# EasyEDA Pro project design-2.eprj, board PCB4_1
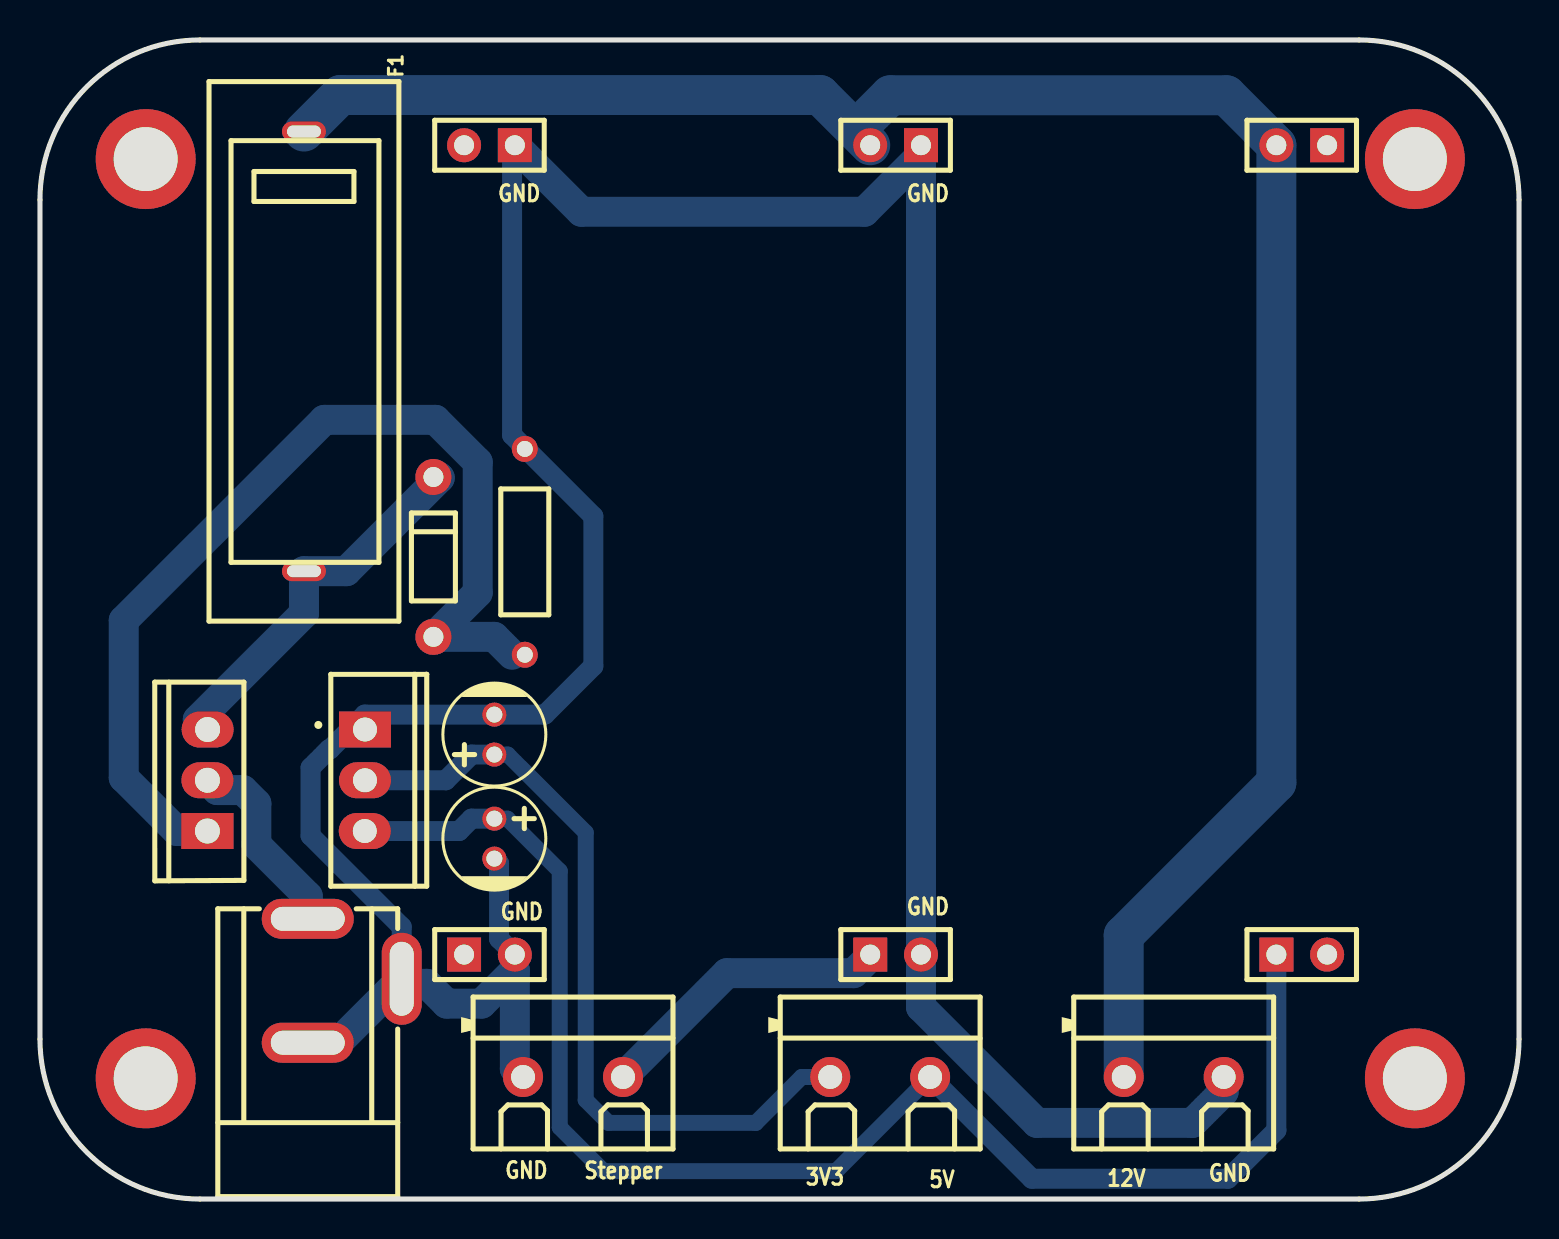
[diagram p2: board, top side]
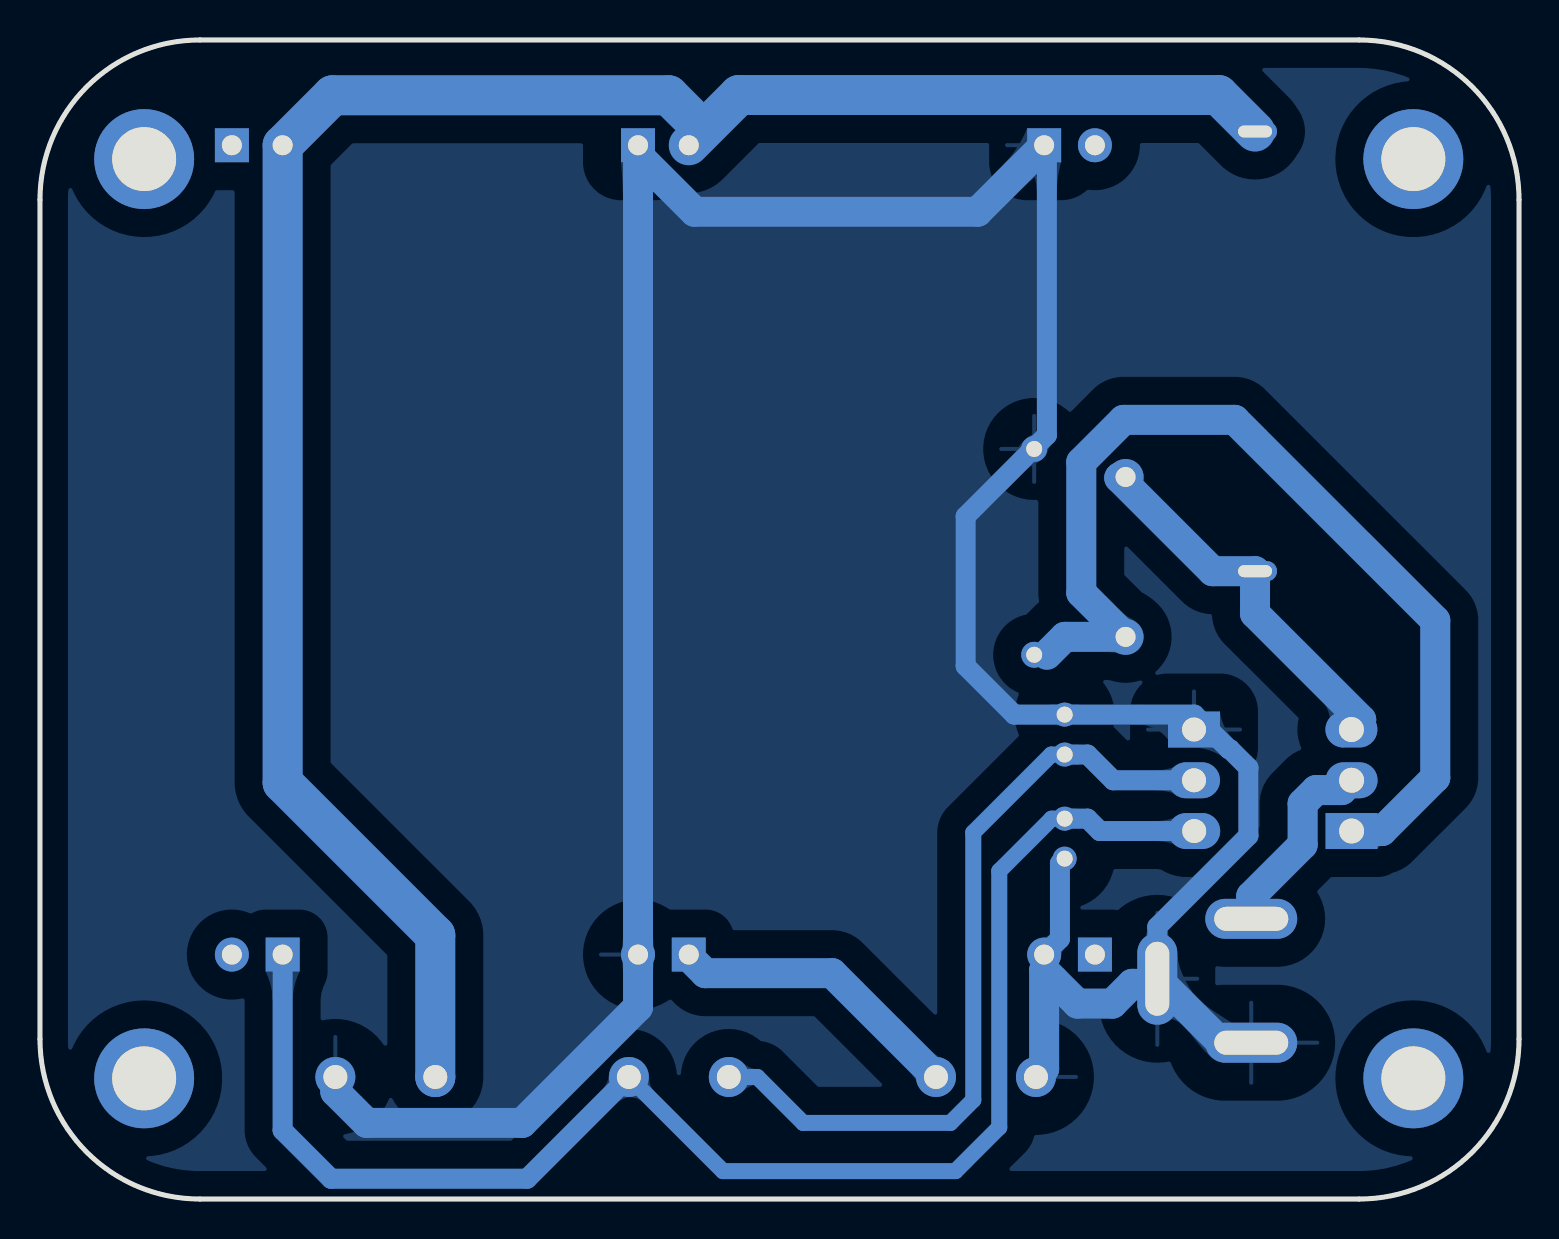
[diagram p3: board, bottom side, seen from below]

Outline 74 x 58 mm; copper layers: Top Layer, Bottom Layer. Coordinates in mm from the lower left corner of the outline.
Outline path: 0,50 arc(2.34,55.66) 8,58 66,58 arc(71.66,55.66) 74,50 74,8 arc(71.66,2.34) 66,0 8,0 arc(2.34,2.34) 0,8 0,50
Stack: Top Layer 0.035mm / Dielectric1 1.51mm FR4 er 4.5 / Bottom Layer 0.035mm

## Design rules (mm)
template: Custom Config
spacing copperThickness1oz (default): track to track 0.4, other pairs 0.4 to 0.6
spacing copperThickness2oz: track to track 0.203, other pairs 0.152 to 0.3
track width copperThickness1oz (default): min 0.4, default 0.5, max 2.54
track width copperThickness2oz: min 0.203, default 0.254, max 2.54
differential pair differentialPair (default): width min 0.127, default 0.254, max 2.54; gap min 0.152, default 0.152
via viaSize (default): diameter min 1.2, default 1.2, max 10; hole min 0.6, default 0.6, max 6.3

## Placement (name value [footprint] x y rotation side)
5V_SHARED+GND_IN1  KF301-2P接线端子  [CONN-TH_XY301V-A-5.0-2P]  42.04 6.11 180 top
5V_STEPPER+GND  KF301-2P接线端子  [CONN-TH_XY301V-A-5.0-2P]  26.67 6.11 180 top
12V_MAIN+GND  KF301-2P接线端子  [CONN-TH_XY301V-A-5.0-2P]  56.72 6.11 180 top
Buck_Pins_#1  2.54-1*2P母  [HDR-TH_2P-P2.54-V-F]  63.13 52.73 180 top
Buck_Pins_#2  2.54-1*2P母  [HDR-TH_2P-P2.54-V-F]  63.13 12.23 0 top
Buck_Pins_#3  2.54-1*2P母  [HDR-TH_2P-P2.54-V-F]  42.81 52.73 180 top
Buck_Pins_#4  2.54-1*2P母  [HDR-TH_2P-P2.54-V-F]  42.81 12.23 0 top
Buck_Pins_#7  2.54-1*2P母  [HDR-TH_2P-P2.54-V-F]  22.49 52.73 180 top
Buck_Pins_#8  2.54-1*2P母  [HDR-TH_2P-P2.54-V-F]  22.49 12.23 0 top
C1  10uF  [CAP-TH_BD5.0-P2.00-D0.6-FD]  22.73 18.03 270 top
C2  10uF  [CAP-TH_BD5.0-P2.00-D0.6-FD]  22.73 23.24 90 top
D4  1N4148  [DO-35_BD2.0-L4.0-P8.00-D0.5-FD]  19.68 32.13 90 top
F1  5x20 BLX-A型 保险丝支架 XC-7  [FUSE-TH_L22.6-W9.0]  13.21 42.42 270 top
Input_Jack  DC005  [DC-IN-TH_DC005]  15.75 10.92 90 top
Mosfet  IRF4905  [TO-220-3_L9.9-W4.5-P2.54-L-1]  8.38 20.95 90 top
NOREF  -  [Pad_e19]  68.79 52.04 0 top
NOREF#2  -  [Pad_e17]  5.29 6.04 0 top
NOREF#3  -  [Pad_e14]  5.29 52.04 0 top
NOREF#4  -  [Pad_e15]  68.79 6.04 0 top
R1  100kΩ  [RES-TH_BD2.4-L6.3-P10.30-D0.6]  24.26 32.38 270 top
U7  LD1117V33  [TO-220-3_L10.0-W4.5-P2.54-L]  16.26 20.95 270 top

## Footprints (pads in the part's own frame, mm; a bottom-side part is the same pattern mirrored in y, then rotated)
CAP-TH_BD5.0-P2.00-D0.6-FD
  round 1.202 hole 0.801: 1(-1,0) 2(1,0)
CONN-TH_XY301V-A-5.0-2P
  round 2 hole 1.2: 1(-2.5,0) 2(2.5,0)
DC-IN-TH_DC005
  oval 2x4.6 hole 1.2x3.7: 1(3.1,2.35) 2(-3.1,2.35)
  oval 4.6x2 hole 3.7x1.2: 3(0.1,-2.35)
DO-35_BD2.0-L4.0-P8.00-D0.5-FD
  round 1.8 hole 1: 1(-4,0) 2(4,0)
FUSE-TH_L22.6-W9.0
  oval 1x2.2 hole 0.6x1.7: 1(-11,0) 2(11,0)
HDR-TH_2P-P2.54-V-F
  rect 1.7x1.7 hole 1: 1(-1.27,0)
  round 1.7 hole 1: 2(1.27,0)
Pad_e14
  round 5 hole 3.2: 1(0,0)
Pad_e15
  round 5 hole 3.2: 1(0,0)
Pad_e17
  round 5 hole 3.2: 1(0,0)
Pad_e19
  round 5 hole 3.2: 1(0,0)
RES-TH_BD2.4-L6.3-P10.30-D0.6
  round 1.3 hole 0.8: 1(-5.15,0) 2(5.15,0)
TO-220-3_L9.9-W4.5-P2.54-L-1
  rect 1.8x2.6 hole 1.25: 1(-2.54,0.005)
  oval 1.8x2.6 hole 1.25: 2(0,0.005) 3(2.54,-0.005)
TO-220-3_L10.0-W4.5-P2.54-L
  rect 1.8x2.6 hole 1.2: 1(-2.54,0.005)
  oval 1.8x2.6 hole 1.2: 2(0,0.005) 3(2.54,-0.005)

## Nets
As in the schematic.

Pads without a net: Buck_Pins_#1 1; Buck_Pins_#2 2; Buck_Pins_#7 2; Buck_Pins_#8 1; NOREF 1; NOREF#2 1; NOREF#3 1; NOREF#4 1

## Routing (per net, layer and track width the routed paths; a pad name or vN(x,y) marks a point on that pad's centre or on a via; arc(x,y) is an arc through that point)
3V3_REF: length 41
  Bottom Layer w0.8: 5V_SHARED+GND_IN1.2 38.11,6.11 35.81,3.81 28.45,3.81 27.3,4.95 27.3,18.34 23.4,22.24 C2.1
  Bottom Layer w1: C2.1 21.59,22.24 20.3,20.95 15.5,20.95
5V_SHARED: length 75.3
  Bottom Layer w0.8: 5V_SHARED+GND_IN1.1 39.83,1.4 28.19,1.4 26.01,3.59 26.01,16.41 23.38,19.03 C1.1
  Bottom Layer w1: C1.1 21.59,19.03 20.97,18.41 15.49,18.41 ; 5V_SHARED+GND_IN1.1 49.63,1.02 59.44,1.02 61.86,3.44 Buck_Pins_#2.1
5V_STEPPER: length 15
  Bottom Layer w1.5: 41.54,12.23 41.54,12.13 40.71,11.3 34.37,11.3 5V_STEPPER+GND.1
12V_MAIN: length 101.6
  Bottom Layer w2: F1.1 15.03,55.24 39.03,55.24 41.54,52.73 ; 41.58,54.27 42.55,55.23 59.36,55.23 Buck_Pins_#1.2 61.86,20.84 54.22,13.2 12V_MAIN+GND.2
GND: length 165.1
  Bottom Layer w1: Buck_Pins_#8.2 22.97,13.02 22.97,16.8 C1.2 ; Buck_Pins_#7.1 23.62,52.59 23.62,38.23 27.69,34.16 27.69,26.67 25.26,24.24 C2.2 16.24,24.24 14.51,22.5 14.46,22.5 13.54,21.59 13.54,18.18 18.1,13.62 18.1,11.02
  Bottom Layer w1.5: 12V_MAIN+GND.1 59.22,5.37 57.66,3.81 49.87,3.81 44.08,9.61 Buck_Pins_#4.2 44.08,52.23 ; Input_Jack.2 14.9,7.82 18.1,11.02 18.35,10.77 19.36,10.77 20.35,9.78 22.09,9.78 23.76,11.45 23.76,6.52 5V_STEPPER+GND.2 ; 44.08,52.23 Buck_Pins_#3.1 ; 44.08,52.23 41.25,49.4 27.09,49.4 Buck_Pins_#7.1
$1N5877: length 19.4
  Bottom Layer w1.5: 8.39,23.49 7.9,23.99 13.21,29.3 F1.2 15.33,31.42 20,36.09 19.96,36.13 D4.2
$1N46155: length 9.8
  Bottom Layer w1.5: 13.4,14.02 13.4,15.16 10.83,17.73 10.83,19.79 10.15,20.46 8.87,20.46 Mosfet.2
$1N54744: length 49.9
  Bottom Layer w1.5: Mosfet.1 6.86,18.41 4.19,21.08 4.19,28.96 14.22,38.99 19.79,38.99 21.9,36.88 21.9,30.34 19.69,28.13 22.73,28.13 23.62,27.23

## Copper pours and planes (outline as drawn; the poured copper is in the pictures)
GND on Bottom Layer: -1.91,59.05 75.56,59.05 75.56,-2.54 -1.91,-2.54

Small or netless copper shapes (teardrops, artwork), in the pictures only: 33 on Bottom Layer

## Text on the board
Top Silkscreen Layer: GND | Stepper | 3V3 | 5V | 12V
